# EAGLE design dev-test (EAGLE 7.3.0)
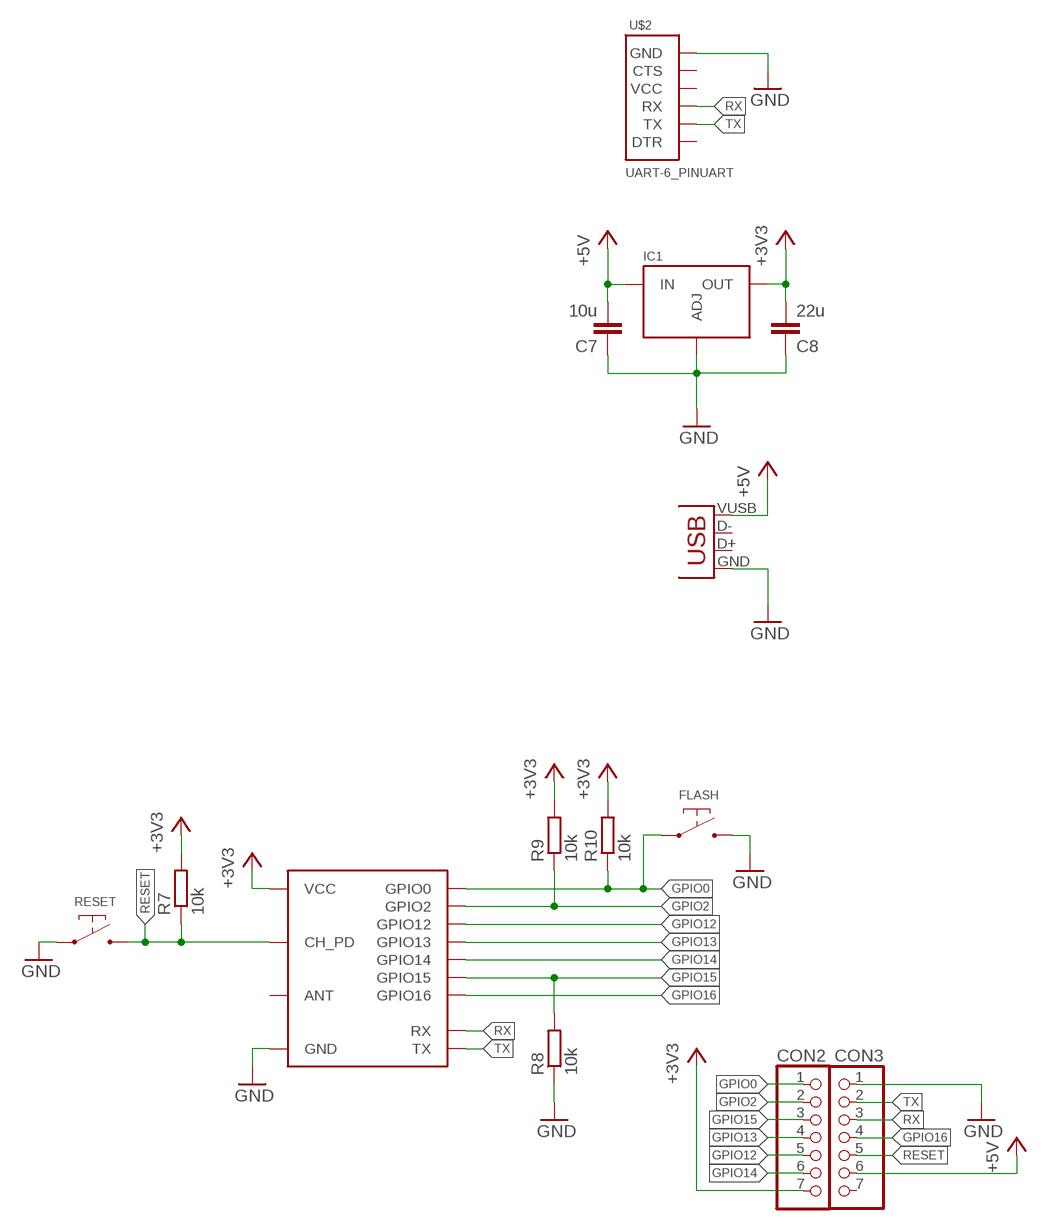
[diagram p0: schematic, sheet 1]

## Parts
C7  10u  C-EUC0805  [C0805]
C8  22u  C-EUC0805  [C0805]
CON1  USBMICRO-NO_CENTER  [USB-MICRO-SMD-NO_CENTER]
CON2  GENERIC-1X7THT  [PINHEADER-100MIL-1X7]
CON3  GENERIC-1X7THT  [PINHEADER-100MIL-1X7]
FLASH  SWITCH-DEFAULT_OFF-SMD-2_PIN  [SWITCH-SMD-2_PIN-DX]
IC1  REGULATOR-LM317-SOT223  [SOT223]
R7  10k  R-EU_R0603  [R0603]
R8  10k  R-EU_R0603  [R0603]
R9  10k  R-EU_R0603  [R0603]
R10  10k  R-EU_R0603  [R0603]
RESET  SWITCH-DEFAULT_OFF-SMD-2_PIN  [SWITCH-SMD-2_PIN-DX]
U$1  ESP8266-03  [ESP8266-ESP-03]
U$2  UART-6_PINUART  [ANGLE-1X6]

## Nets
+3V3: C8.2 CON2.7 IC1.2(OUT) IC1.4(OUT) R7.2 R9.2 R10.2 U$1.P$8(VCC)
+5V: C7.2 CON1.VUSB(VBUS) CON3.6 IC1.3(IN)
GND: C7.1 C8.1 CON1.GND CON3.1 FLASH.P$2 IC1.1(ADJ) R8.1 RESET.P$1 U$1.P$1(GND) U$2.1(GND)
GPIO0: CON2.1 FLASH.P$1 R10.1 U$1.P$14(GPIO0)
GPIO2: CON2.2 R9.1 U$1.P$13(GPIO2)
GPIO12: CON2.5 U$1.P$10(GPIO12)
GPIO13: CON2.4 U$1.P$11(GPIO13)
GPIO14: CON2.6 U$1.P$9(GPIO14)
GPIO15: CON2.3 R8.2 U$1.P$12(GPIO15)
GPIO16: CON3.4 U$1.P$5(GPIO16)
RESET: CON3.5 R7.1 RESET.P$2 U$1.P$6(CH_PD)
RX: CON3.3 U$1.P$4(RX) U$2.4(RX)
TX: CON3.2 U$1.P$3(TX) U$2.5(TX)
Unconnected: CON1.D+ CON1.D- CON3.7 U$1.P$7(ANT) U$2.2(CTS) U$2.3(VCC) U$2.6(DTR)

## Library data of the parts
C7 C8 = p.peter-rcl:C-EU: CAPACITOR, European symbol
CON1 = p.peter-connectors:USB
CON2 CON3 = p.peter-connectors:GENERIC-1X7
FLASH RESET = p.peter-passives:SWITCH-DEFAULT_OFF
IC1 = p.peter-regulators:REGULATOR-LM317
R7-R10 = p.peter-rcl:R-EU_: RESISTOR, European symbol
U$1 = p.peter-periphery:ESP8266-03
U$2 = p.peter-connectors:UART-6_PIN: RX and TX direction as seen from outside. I.e. connect RX from connector to RX from Atmega

## Board
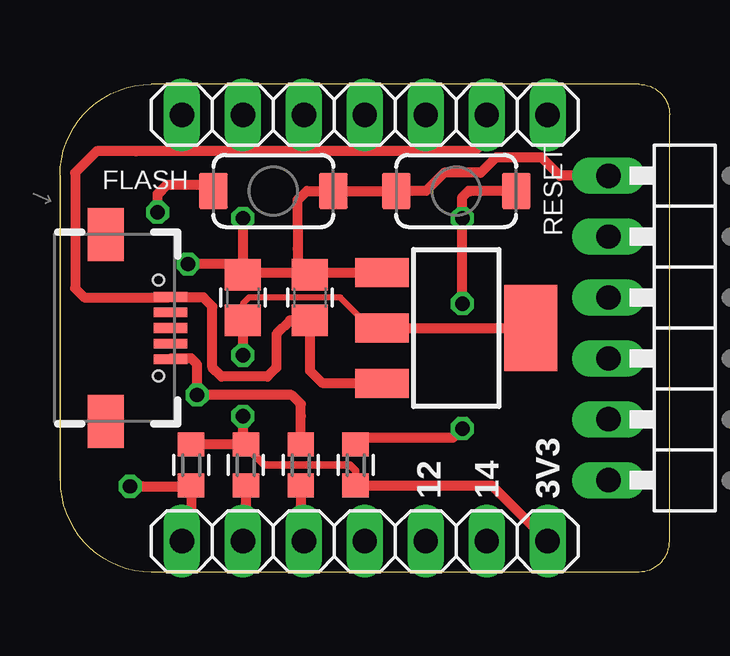
[diagram p1: board, top side]
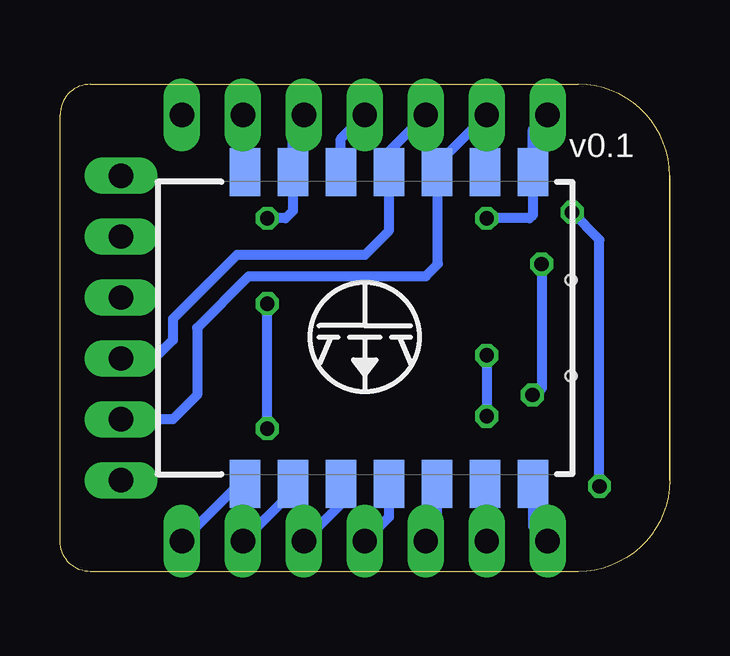
[diagram p2: board, bottom side, seen from below]

Size 25.4 x 20.32 mm. Coordinates in mm from the lower left corner, seen from the top.
Outline: 0,3.81 0,7.62 0,16.51
Outline: 0,16.51 arc-90 3.81,20.32 24.13,20.32 arc-90 25.4,19.05 25.4,1.27 arc-90 24.13,0 3.81,0 arc-90 0,3.81
Outline: 0,16.51 0,3.81
Copper layers (1*16): Top 0.0356mm / dielectric 1.5011mm / Bottom 0.0356mm
Design rules "oshpark": minimum track width 6mil, minimum drill 13mil, track to track 6mil, track to pad 6mil, pad to pad 6mil, via to via 6mil, smd to smd 6mil, copper to edge 15mil, drill to drill 6mil, minimum pad ring 7mil, minimum via ring 7mil, stop-mask expansion 4mil, vias tented up to drill 4.1mm, thermal gap 10mil

### Footprints (pad centres in the part's own frame; a part is rotated, then mirrored left to right if it is on the bottom)
C0805 = smd 1.3 x 1.5: 1 -0.95,0; 2 0.95,0
USB-MICRO-SMD-NO_CENTER = smd 1.4 x 0.4: D+ 1.43,0; D- 1.43,0.65; GND 1.43,-1.3; ID 1.43,-0.65; VUSB 1.43,1.3 | smd 1.5 x 2.2: P$1 -1.27,3.9; P$2 -1.27,-3.9 | hole 0.45: 0.93,2; 0.93,-2
PINHEADER-100MIL-1X7 = drill 1.016 long: 1 -7.62,0; 2 -5.08,0; 3 -2.54,0; 4 0,0; 5 2.54,0; 6 5.08,0; 7 7.62,0
SWITCH-SMD-2_PIN-DX = smd 1.2 x 1.5: P$1 -2.5,0; P$2 2.5,0
SOT223 = smd 1.219 x 2.235: 1 -2.311,-3.099; 2 0,-3.099; 3 2.311,-3.099 | smd 3.6 x 2.2: 4 0,3.099
R0603 = smd 1 x 1.1: 1 -0.85,0; 2 0.85,0
ESP8266-ESP-03 = smd 1.27 x 2: P$1 7,6.5; P$2 5,6.5; P$3 3,6.5; P$4 1,6.5; P$5 -1,6.5; P$6 -3,6.5; P$7 -5,6.5; P$8 -5,-6.5; P$9 -3,-6.5; P$10 -1,-6.5; P$11 1,-6.5; P$12 3,-6.5; P$13 5,-6.5; P$14 7,-6.5
ANGLE-1X6 = drill 1.016 long: 1 -6.35,-2.54; 2 -3.81,-2.54; 3 -1.27,-2.54; 4 1.27,-2.54; 5 3.81,-2.54; 6 6.35,-2.54

### Placement (x,y rotation side)
C7  10.41,11.43 270 top
C8  7.62,11.43 270 top
CON1  3.17,10.16 0 top
CON2  12.7,1.27 0 top
CON3  12.7,19.05 0 top
FLASH  8.89,15.88 0 top
IC1  16.51,10.16 270 top
R7  12.32,4.45 270 top
R8  10.03,4.45 270 top
R9  7.75,4.45 90 top
R10  5.46,4.45 90 top
RESET  16.51,15.88 0 top
U$1  12.7,10.16 0 bottom
U$2  25.4,10.16 270 top
U$3  [LOGO-JUSTGEEK-XS]  12.7,9.78 0 bottom

### Tracks (layer width: path | path; a pad name or v marks a point on that pad's centre or on a via)
+3V3  (via drill 0.6 pad 0.41)
  Top 0.254: 12.83,10.29 11.68,11.43 7.87,11.43 7.62,11.18 C8.2
  Top 0.305: 7.75,5.21 8.51,4.45 12.06,4.45 12.32,4.19 R7.2
  Top 0.406: IC1.2 13.41,10.24 13.46,10.29 | 13.46,10.29 12.83,10.29 | R7.2 18,3.6 CON2.7 | R10.2 5.46,5.33 7.71,5.33 R9.2 | R9.2 7.75,5.21 | 13.46,10.29 13.46,10.16 IC1.4 | C8.2 7.62,10.41 v7.62,9.02 | v7.62,6.48 7.62,5.42 R9.2
  Bottom 0.406: U$1.P$8 17.93,3.66 CON2.7 | v7.62,9.02 v7.62,6.48
+5V
  Top 0.406: IC1.3 13.39,7.87 10.92,7.87 10.41,8.38 C7.2 9.59,10.48 9.02,9.91 9.02,8.51 8.64,8.13 6.73,8.13 6.35,8.51 6.35,11.05 5.97,11.43 4.63,11.43 CON1.VUSB 4.51,11.43 1.02,11.43 0.64,11.81 0.64,16.64 1.52,17.53 3.17,17.53 17.27,17.53 17.78,18.03 CON3.6
GND  (via drill 0.6 pad 0.41)
  Top 0.305: 4.63,8.89 CON1.GND
  Top 0.406: C7.1 10.23,12.45 13.34,12.45 13.36,12.47 IC1.1 12.8,12.47 | C7.1 10.16,12.45 7.69,12.45 C8.1 | C8.1 7.56,12.38 7.49,12.45 7.49,12.7 7.62,12.83 v5.33,12.83 | R8.1 10.03,6.48 10.03,6.99 9.65,7.37 v5.71,7.37 5.71,8.64 5.46,8.89 4.63,8.89 | C7.1 9.91,12.63 9.91,13.46 9.91,14.35 9.91,15.49 10.29,15.88 FLASH.P$2 RESET.P$1 15.24,15.88 16,16.64 17.53,16.64 18.16,17.27 20.07,17.27 20.83,16.51 U$2.1 | v7.62,14.73 C8.1
  Bottom 0.406: CON3.1 5.7,18.43 U$1.P$1 5.7,14.87 5.84,14.73 v7.62,14.73 | v5.33,12.83 5.33,7.62 v5.71,7.37
GPIO0  (via drill 0.6 pad 0.41)
  Top 0.406: CON2.1 5.46,1.65 R10.1 5.42,3.56 3.43,3.56 v2.92,3.56 | v4.06,14.99 4.06,15.75 4.45,16.13 6.14,16.13 FLASH.P$1
  Bottom 0.406: U$1.P$14 5.7,1.89 CON2.1 | v2.92,3.56 2.92,13.84 v4.06,14.99
GPIO2
  Top 0.406: R9.1 7.75,1.4 CON2.2
  Bottom 0.406: U$1.P$13 7.7,1.35 CON2.2
GPIO12
  Bottom 0.406: U$1.P$10 13.7,2.81 CON2.5
GPIO13
  Bottom 0.406: U$1.P$11 11.7,2.27 CON2.4
GPIO14
  Bottom 0.406: U$1.P$9 15.7,3.35 CON2.6
GPIO15
  Top 0.406: R8.2 10.03,1.4 CON2.3
  Bottom 0.406: U$1.P$12 9.7,1.73 CON2.3
GPIO16
  Bottom 0.406: U$1.P$5 13.7,18.05 CON3.4
RESET  (via drill 0.6 pad 0.41)
  Top 0.406: R7.1 12.32,5.59 16.38,5.59 v16.76,5.97 | RESET.P$2 17.14,15.88 | 17.14,15.88 17.02,15.88 | 17.02,15.88 17.14,15.88 | v16.76,11.18 v16.76,14.73 16.76,15.62 17.02,15.88
  Bottom 0.406: U$1.P$6 15.7,18.59 CON3.5 | 15.75,16.61 U$1.P$6 | v16.76,5.97 v16.76,11.18 | U$1.P$6 15.7,15.03 16,14.73 v16.76,14.73
RX
  Bottom 0.406: CON3.3 11.7,17.51 U$1.P$4 11.68,16.64 11.68,14.22 12.7,13.21 18.03,13.21 20.7,10.54 20.7,9.65 21.46,8.89 U$2.4
TX
  Bottom 0.406: CON3.2 9.7,16.97 U$1.P$3 9.65,16.61 9.65,12.83 10.16,12.32 17.53,12.32 19.68,10.16 19.68,7.37 20.7,6.35 U$2.5

### Text on the board
tPlace: 12 | 14 | 3V3
bPlace: v0.1